# Altium schematic sheet SCH_Timer.SchDoc
size C
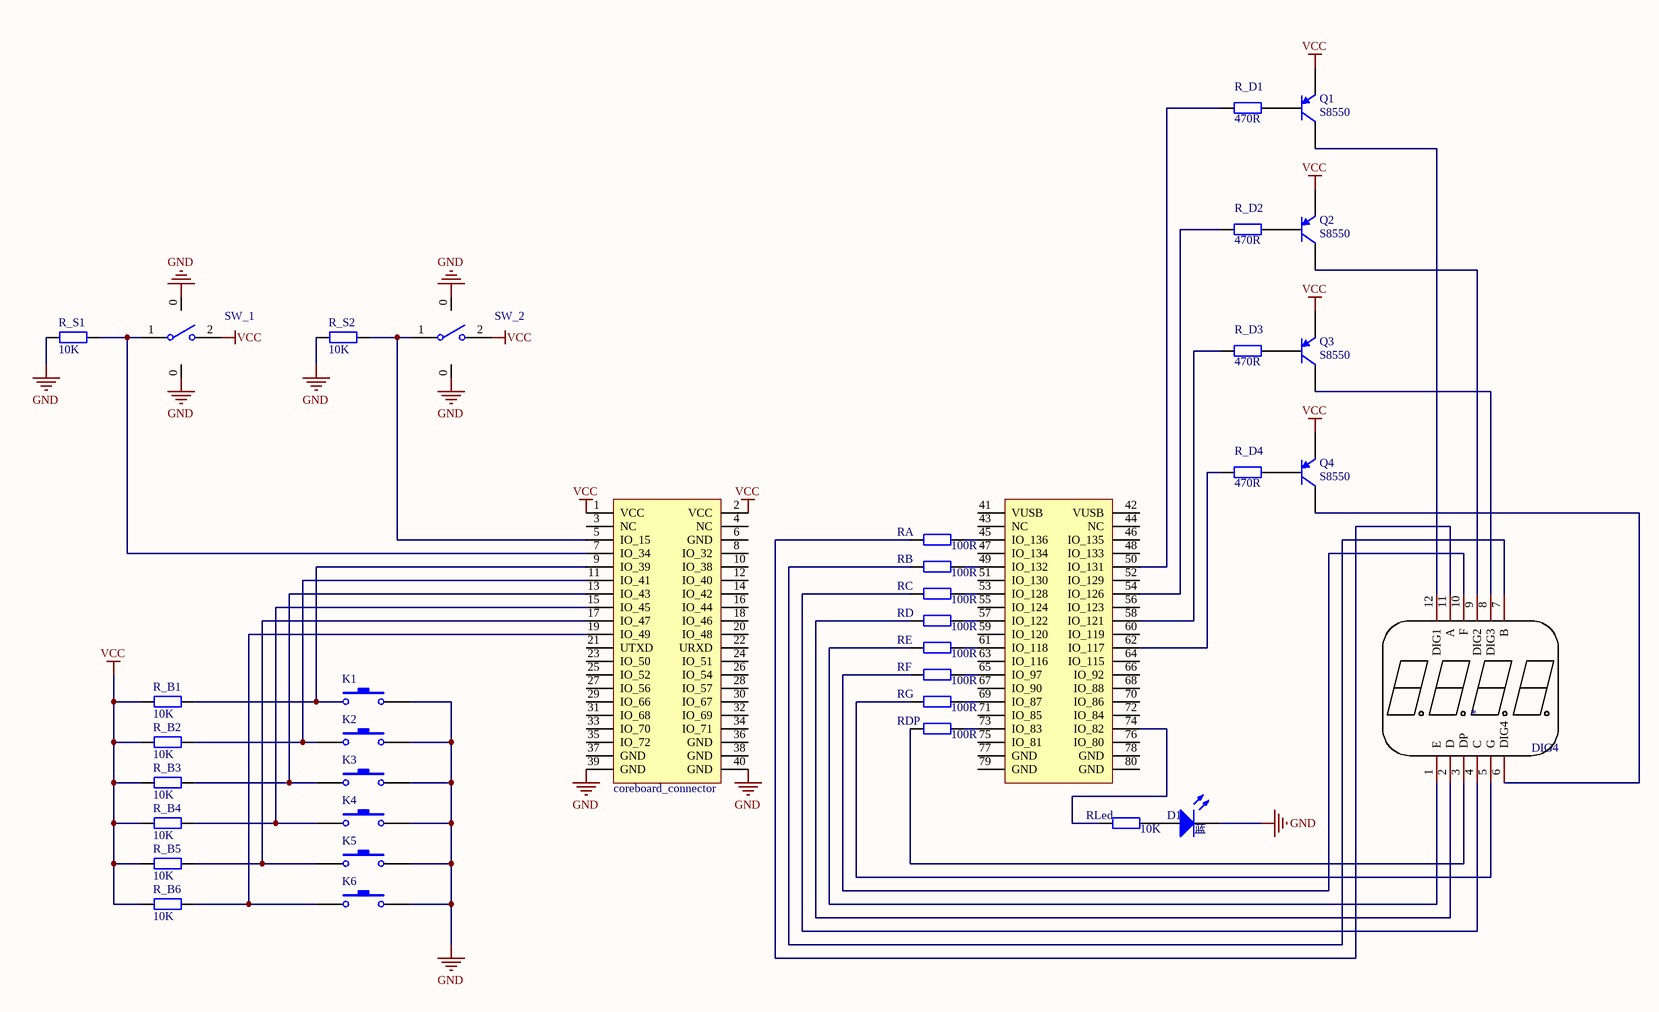
[diagram p0: SCH_Timer.SchDoc]

## Parts
coreboard_connector  (no value)  [coreboard_connector]
D1  蓝  [LED_TH_HLMP4700]
DIG4  *  [DIG-4]
K1  (no value)  [TS665CJ]
K2  SW-PB  [TS665CJ]  (value not drawn)
K3  SW-PB  [TS665CJ]  (value not drawn)
K4  SW-PB  [TS665CJ]  (value not drawn)
K5  (no value)  [TS665CJ]
K6  (no value)  [TS665CJ]
Q1  S8550  [TO-92]
Q2  S8550  [TO-92]
Q3  S8550  [TO-92]
Q4  S8550  [TO-92]
R_B1  10K  [AXIAL-0.5]
R_B2  10K  [AXIAL-0.5]
R_B3  10K  [AXIAL-0.5]
R_B4  10K  [AXIAL-0.5]
R_B5  10K  [AXIAL-0.5]
R_B6  10K  [AXIAL-0.5]
R_D1  470R  [AXIAL-0.5]
R_D2  470R  [AXIAL-0.5]
R_D3  470R  [AXIAL-0.5]
R_D4  470R  [AXIAL-0.5]
R_S1  10K  [AXIAL-0.5]
R_S2  10K  [AXIAL-0.5]
RA  value 100R  [AXIAL-0.5]
RB  value 100R  [AXIAL-0.5]
RC  value 100R  [AXIAL-0.5]
RD  value 100R  [AXIAL-0.5]
RDP  value 100R  [AXIAL-0.5]
RE  value 100R  [AXIAL-0.5]
RF  value 100R  [AXIAL-0.5]
RG  value 100R  [AXIAL-0.5]
RLed  value 10K  [AXIAL-0.5]
SW_1  (no value)  [SW-DP_5P_W]
SW_2  (no value)  [SW-DP_5P_W]

## Nets
GND: coreboard_connector.39(GND) coreboard_connector.40(GND) D1.2(K) K1.2 K2.2 K3.2 K4.2 K5.2 K6.2 R_S1.1 R_S2.1 SW_1.0 SW_2.0
VCC: coreboard_connector.1(VCC) coreboard_connector.2(VCC) Q1.1(E) Q2.1(E) Q3.1(E) Q4.1(E) R_B1.1 R_B2.2 R_B3.2 R_B4.1 R_B5.2 R_B6.2 SW_1.2 SW_2.2
Netcoreboard_connector_5: coreboard_connector.5(IO_15) R_S2.2 SW_2.1
Netcoreboard_connector_7: coreboard_connector.7(IO_34) R_S1.2 SW_1.1
Netcoreboard_connector_9: coreboard_connector.9(IO_39) K1.1 R_B1.2
Netcoreboard_connector_11: coreboard_connector.11(IO_41) K2.1 R_B2.1
Netcoreboard_connector_13: coreboard_connector.13(IO_43) K3.1 R_B3.1
Netcoreboard_connector_15: coreboard_connector.15(IO_45) K4.1 R_B4.2
Netcoreboard_connector_17: coreboard_connector.17(IO_47) K5.1 R_B5.1
Netcoreboard_connector_19: coreboard_connector.19(IO_49) K6.1 R_B6.1
Netcoreboard_connector_45: coreboard_connector.45(IO_136) RA.2
Netcoreboard_connector_49: coreboard_connector.49(IO_132) RB.2
Netcoreboard_connector_50: coreboard_connector.50(IO_131) R_D1.1
Netcoreboard_connector_53: coreboard_connector.53(IO_128) RC.2
Netcoreboard_connector_54: coreboard_connector.54(IO_126) R_D2.1
Netcoreboard_connector_57: coreboard_connector.57(IO_122) RD.2
Netcoreboard_connector_58: coreboard_connector.58(IO_121) R_D3.1
Netcoreboard_connector_61: coreboard_connector.61(IO_118) RE.2
Netcoreboard_connector_62: coreboard_connector.62(IO_117) R_D4.1
Netcoreboard_connector_65: coreboard_connector.65(IO_97) RF.2
Netcoreboard_connector_69: coreboard_connector.69(IO_87) RG.2
Netcoreboard_connector_73: coreboard_connector.73(IO_83) RDP.2
Netcoreboard_connector_74: coreboard_connector.74(IO_82) RLed.1
NetD1_1: D1.1(A) RLed.2
NetDIG4_1: DIG4.1(E) RE.1
NetDIG4_2: DIG4.2(D) RD.1
NetDIG4_3: DIG4.3(DP) RDP.1
NetDIG4_4: DIG4.4(C) RC.1
NetDIG4_5: DIG4.5(G) RG.1
NetDIG4_6: DIG4.6(DIG4) Q4.3(C)
NetDIG4_7: DIG4.7(B) RB.1
NetDIG4_8: DIG4.8(DIG3) Q3.3(C)
NetDIG4_9: DIG4.9(DIG2) Q2.3(C)
NetDIG4_10: DIG4.10(F) RF.1
NetDIG4_11: DIG4.11(A) RA.1
NetDIG4_12: DIG4.12(DIG1) Q1.3(C)
NetQ1_2: Q1.2(B) R_D1.2
NetQ2_2: Q2.2(B) R_D2.2
NetQ3_2: Q3.2(B) R_D3.2
NetQ4_2: Q4.2(B) R_D4.2

Not connected (* = marked no-connect by the designer): coreboard_connector 3(NC) 4(NC) 6(GND) 8(IO_32) 10(IO_38) 12(IO_40) 14(IO_42) 16(IO_44) 18(IO_46) 20(IO_48) 21(UTXD) 22(URXD) 23(IO_50) 24(IO_51) 25(IO_52) 26(IO_54) 27(IO_56) 28(IO_57) 29(IO_66) 30(IO_67) 31(IO_68) 32(IO_69) 33(IO_70) 34(IO_71) 35(IO_72) 36(GND) 37(GND) 38(GND) 41(VUSB) 42(VUSB) 43(NC) 44(NC) 46(IO_135) 47(IO_134) 48(IO_133) 51(IO_130) 52(IO_129) 55(IO_124) 56(IO_123) 59(IO_120) 60(IO_119) 63(IO_116) 64(IO_115) 66(IO_92) 67(IO_90) 68(IO_88) 70(IO_86) 71(IO_85) 72(IO_84) 75(IO_81) 76(IO_80) 77(GND) 78(GND) 79(GND) 80(GND)

## Library data of the parts
coreboard_connector = J1 & J2
D1 = LED1: Typical RED GaAs LED; Published: 8-Jun-2000; LatestRevisionDate: 08-Jul-2005; LatestRevisionNote: Mech Layer 1 removed.; PackageReference: LED-1; Publisher: Altium Limited; PackageDescription: LED; 2 Leads
DIG4 = DIG-4
K1-K6 = SW-PB: Switch; pin to pad: 1>A1 2>B1; Published: 24-Mar-1999; LatestRevisionDate: 17-Jul-2002; LatestRevisionNote: Re-released for DXP Platform.; PackageReference: SPST-2; Publisher: Altium Limited; PackageDescription: Switch; 2 Leads
Q1-Q4 = 2N3906: PNP General Purpose Amplifier; Published: 8-Jun-2000; LatestRevisionDate: 15-Jan-2003; LatestRevisionNote: PCB Footprint 'BCY-W3/D4.7' replaced; DatasheetVersion: 1997; PackageVersion: Sep-1998; PackageReference: TO-92A; Publisher: Altium Limited; PackageDescription: TO, Flat Index; 3 In-Line, Axial Leads; Body Dia. 4.5mm; Leads 0.51 x 0.48 mm (max); ComponentLink1Description: Manufacturer Link; ComponentLink1URL: http://www.fairchildsemi.com/; ComponentLink2Description: Datasheet; ComponentLink2URL: http://www.fairchildsemi.com/ds/2N%2F2N3906.pdf
R_B1-R_B6 R_S1 R_S2 = AXIAL-0.5
R_D1-R_D4 RA RB RC RD RDP RE RF RG RLed = Res2: Resistor; Published: 8-Jun-2000; LatestRevisionDate: 17-Jul-2002; LatestRevisionNote: Re-released for DXP Platform.; PackageReference: AXIAL-0.4; Publisher: Altium Limited; PackageDescription: Axial Device, Thru-Hole; 2 Leads; 0.4 in Pin Spacing
SW_1 SW_2 = SW-DP_5P_W